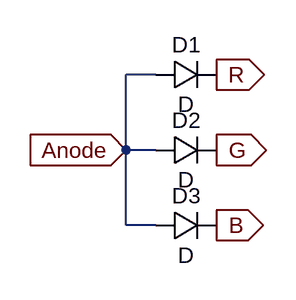
[diagram p0: schematic KingbrightLED.asc]
KingbrightLED.asc, the LTspice schematic file:
Version 4
SHEET 1 880 680
WIRE 144 176 112 176
WIRE 112 256 112 176
WIRE 144 256 112 256
WIRE 112 336 112 256
WIRE 144 336 112 336
FLAG 112 256 Anode
IOPIN 112 256 In
FLAG 208 176 R
IOPIN 208 176 Out
FLAG 208 256 G
IOPIN 208 256 Out
FLAG 208 336 B
IOPIN 208 336 Out
SYMBOL diode 144 192 R270
WINDOW 0 32 32 VTop 2
WINDOW 3 0 32 VBottom 2
SYMATTR InstName D1
SYMBOL diode 144 272 R270
WINDOW 0 32 32 VTop 2
WINDOW 3 0 32 VBottom 2
SYMATTR InstName D2
SYMBOL diode 144 352 R270
WINDOW 0 32 32 VTop 2
WINDOW 3 0 32 VBottom 2
SYMATTR InstName D3

The netlist it stands for:
* KingbrightLED.asc
D1 Anode R D
D2 Anode G D
D3 Anode B D
.model D D
.lib standard.dio
.backanno
.end